# EAGLE design Binary_Sequencer_board1_Arduino (EAGLE 9.1.1)
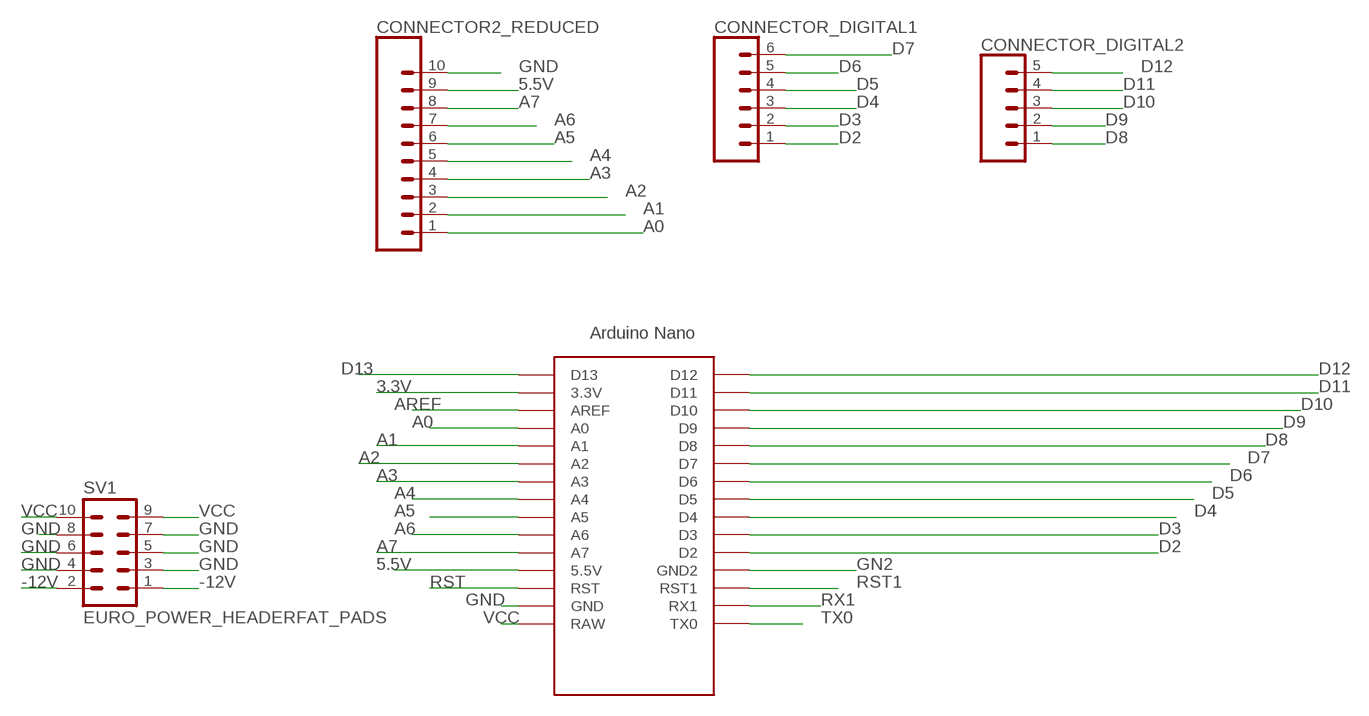
[diagram p0: schematic, sheet 1]

## Parts
CONNECTOR2_REDUCED  CONN_10_LONGPADS10_LONGPADS  [1X10_LONGPADS]
CONNECTOR_DIGITAL1  CONN_06LONGPADS  [1X06_LONGPADS]
CONNECTOR_DIGITAL2  CONN_05PTH_LONGPADS  [1X05_LONGPADS]
SV1  EURO_POWER_HEADERFAT_PADS  [EURO_PWR_HEADER_FAT]
U$1  NANO  [NANO]

## Nets
3.3V: U$1.3.3V
5.5V: CONNECTOR2_REDUCED.9 U$1.5V(5.5V)
-12V: SV1.1 SV1.2
A0: CONNECTOR2_REDUCED.1 U$1.A0
A1: CONNECTOR2_REDUCED.2 U$1.A1
A2: CONNECTOR2_REDUCED.3 U$1.A2
A3: CONNECTOR2_REDUCED.4 U$1.A3
A4: CONNECTOR2_REDUCED.5 U$1.A4
A5: CONNECTOR2_REDUCED.6 U$1.A5
A6: CONNECTOR2_REDUCED.7 U$1.A6
A7: CONNECTOR2_REDUCED.8 U$1.A7
AREF: U$1.AREF
D2: CONNECTOR_DIGITAL1.1 U$1.D2
D3: CONNECTOR_DIGITAL1.2 U$1.D3
D4: CONNECTOR_DIGITAL1.3 U$1.D4
D5: CONNECTOR_DIGITAL1.4 U$1.D5
D6: CONNECTOR_DIGITAL1.5 U$1.D6
D7: CONNECTOR_DIGITAL1.6 U$1.D7
D8: CONNECTOR_DIGITAL2.1 U$1.D8
D9: CONNECTOR_DIGITAL2.2 U$1.D9
D10: CONNECTOR_DIGITAL2.3 U$1.D10
D11: CONNECTOR_DIGITAL2.4 U$1.D11
D12: CONNECTOR_DIGITAL2.5 U$1.D12
D13: U$1.D13
GN2: U$1.GND1(GND2)
GND: CONNECTOR2_REDUCED.10 SV1.3 SV1.4 SV1.5 SV1.6 SV1.7 SV1.8 U$1.GND
RST: U$1.RST
RST1: U$1.RST1
RX1: U$1.RX1
TX0: U$1.TX0
VCC: SV1.9 SV1.10 U$1.RAW

## Library data of the parts
CONNECTOR2_REDUCED = 10_Long_Pads:CONN_10_LONGPADS: Multi connection point. Often used as Generic Header-pin footprint for 0.1 inch spaced/style header connections On any of the 0.1 inch spaced packages, you can populate with these: Break Away Headers - Straight <https://www.sparkfun.com/products/116> (PRT-00116) Break Away Male Headers - Right Angle <https://www.sparkfun.com/products/553> (PRT-00553) Female Headers <https://www.sparkfun.com/products/115> (PRT-00115) Break Away Headers - Machine Pin <https://www.sparkfun.com/products/117> (PRT-00117) Break Away Female Headers - Swiss Machine Pin <https://www.sparkfun.com/products/743> (PRT-00743) For SCREWTERMINALS and SPRING TERMINALS visit here: Screw Terimnals on SparkFun.com <https://www.sparkfun.com/search/results?term=Screw+Terminals> (5mm/3.5mm/2.54mm spacing) This device is also useful as a general connection point to wire up your design to another part of your project. Our various solder wires solder well into these plated through hole pads. Hook-Up Wire - Assortment (Stranded, 22 AWG) <https://www.sparkfun.com/products/11375> (PRT-11375) Hook-Up Wire - Assortment (Solid Core, 22 AWG) <https://www.sparkfun.com/products/11367> (PRT-11367) View the entire wire category on our website here <https://www.sparkfun.com/categories/141>
CONNECTOR_DIGITAL1 = SparkFun-Connectors:CONN_06: Multi connection point. Often used as Generic Header-pin footprint for 0.1 inch spaced/style header connections On any of the 0.1 inch spaced packages, you can populate with these: Break Away Headers - Straight <https://www.sparkfun.com/products/116> (PRT-00116) Break Away Male Headers - Right Angle <https://www.sparkfun.com/products/553> (PRT-00553) Female Headers <https://www.sparkfun.com/products/115> (PRT-00115) Break Away Headers - Machine Pin <https://www.sparkfun.com/products/117> (PRT-00117) Break Away Female Headers - Swiss Machine Pin <https://www.sparkfun.com/products/743> (PRT-00743) Arduino Stackable Header - 6 Pin <https://www.sparkfun.com/products/9280> (PRT-09280) For SCREWTERMINALS and SPRING TERMINALS visit here: Screw Terimnals on SparkFun.com <https://www.sparkfun.com/search/results?term=Screw+Terminals> (5mm/3.5mm/2.54mm spacing) This device is also useful as a general connection point to wire up your design to another part of your project. Our various solder wires solder well into these plated through hole pads. Hook-Up Wire - Assortment (Stranded, 22 AWG) <https://www.sparkfun.com/products/11375> (PRT-11375) Hook-Up Wire - Assortment (Solid Core, 22 AWG) <https://www.sparkfun.com/products/11367> (PRT-11367) View the entire wire category on our website here <https://www.sparkfun.com/categories/141>
CONNECTOR_DIGITAL2 = SparkFun-Connectors:CONN_05: Multi connection point. Often used as Generic Header-pin footprint for 0.1 inch spaced/style header connections On any of the 0.1 inch spaced packages, you can populate with these: Break Away Headers - Straight <https://www.sparkfun.com/products/116> (PRT-00116) Break Away Male Headers - Right Angle <https://www.sparkfun.com/products/553> (PRT-00553) Female Headers <https://www.sparkfun.com/products/115> (PRT-00115) Break Away Headers - Machine Pin <https://www.sparkfun.com/products/117> (PRT-00117) Break Away Female Headers - Swiss Machine Pin <https://www.sparkfun.com/products/743> (PRT-00743) For SCREWTERMINALS and SPRING TERMINALS visit here: Screw Terimnals on SparkFun.com <https://www.sparkfun.com/search/results?term=Screw+Terminals> (5mm/3.5mm/2.54mm spacing) This device is also useful as a general connection point to wire up your design to another part of your project. Our various solder wires solder well into these plated through hole pads. Hook-Up Wire - Assortment (Stranded, 22 AWG) <https://www.sparkfun.com/products/11375> (PRT-11375) Hook-Up Wire - Assortment (Solid Core, 22 AWG) <https://www.sparkfun.com/products/11367> (PRT-11367) View the entire wire category on our website here <https://www.sparkfun.com/categories/141> Special notes: Molex polarized connector foot print use with SKU : PRT-08231 with associated crimp pins and housings. 1MM SMD Version SKU: PRT-10208
SV1 = MusicThingModular:EURO_POWER_HEADER: Power Header 10 pin power header for Eurorack Power Supplies Variants with fatter pads for easier soldering, and the LOCK variant which has 5mil offset pins to hold the component in place before soldering
U$1 = Arduino-clone_EDITED_coordinates:NANO: Arduino Nano

## Board
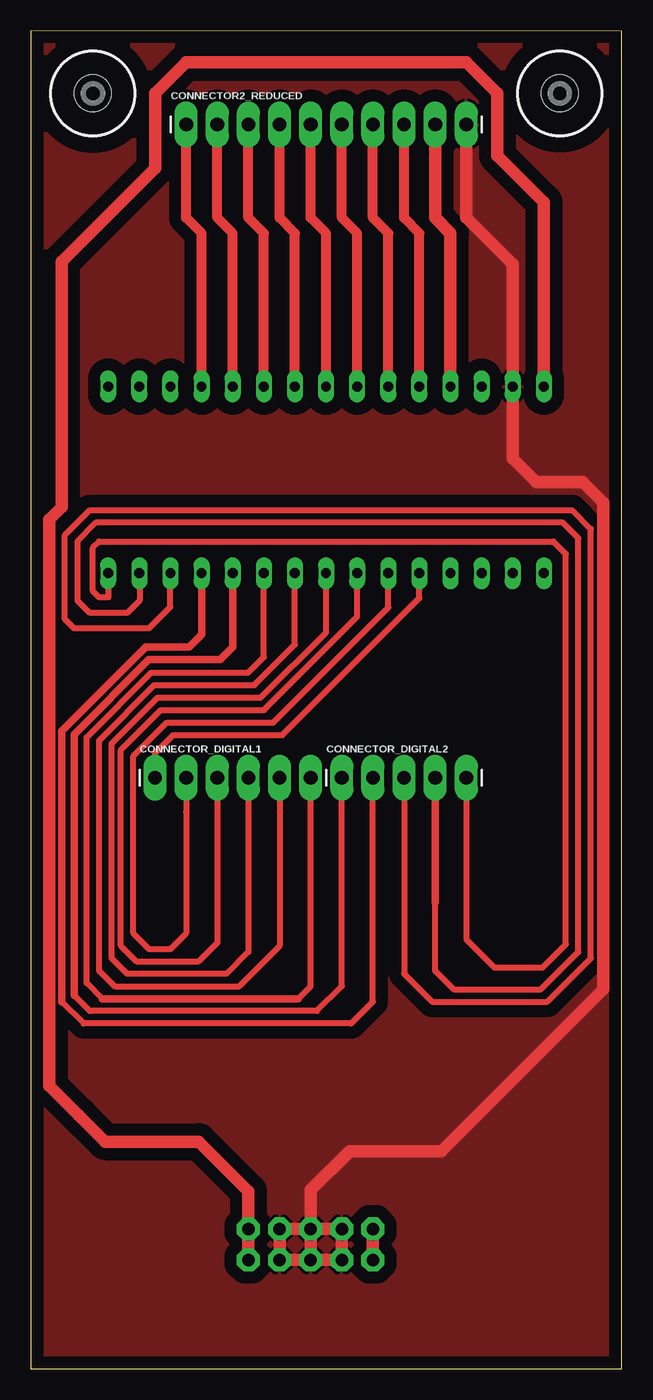
[diagram p1: board, top side]
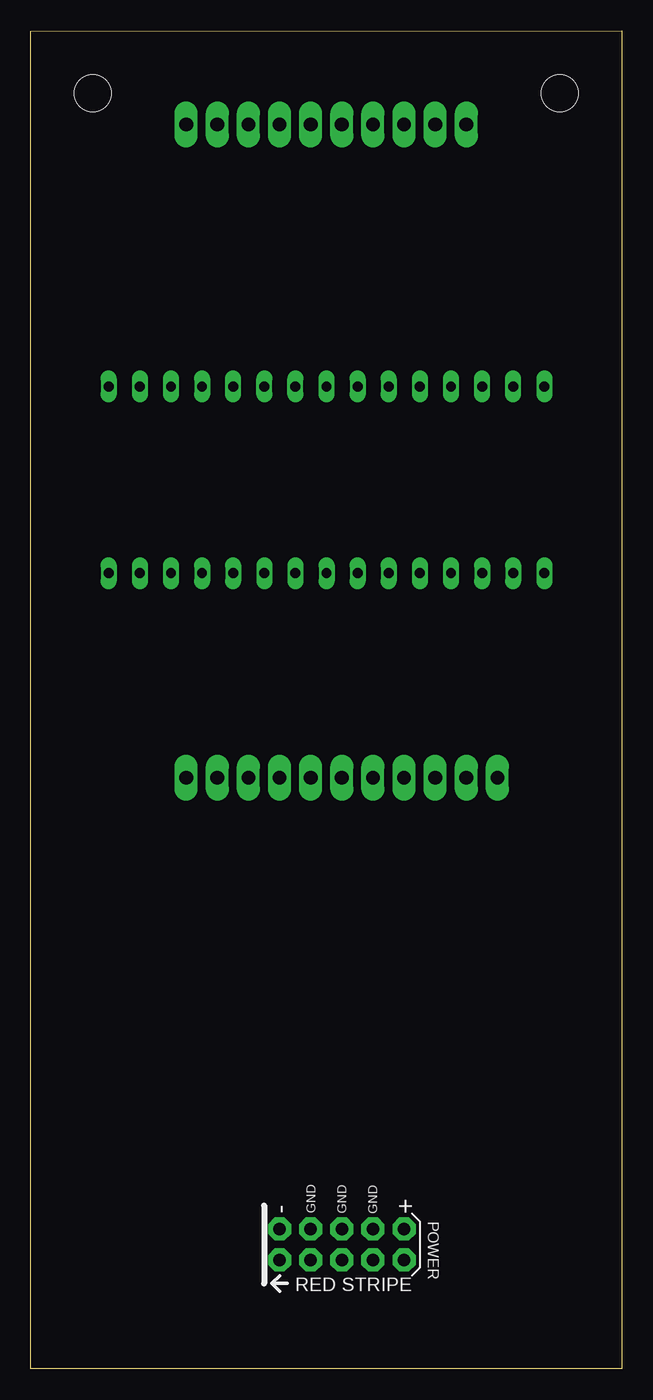
[diagram p2: board, bottom side, seen from below]

Size 48.26 x 109.27 mm. Coordinates in mm from the lower left corner, seen from the top.
Outline: 0,0 48.26,0 48.26,109.22 0,109.27 0,0
Copper layers (1*16): Top 0.035mm / dielectric 1.5mm / Bottom 0.035mm
Design rules "default": minimum track width 6mil, minimum drill 0.35mm, track to track 6mil, track to pad 6mil, pad to pad 6mil, via to via 6mil, smd to smd 6mil, copper to edge 40mil, drill to drill 6mil, minimum pad ring 10mil, minimum via ring 8mil, stop-mask expansion 4mil, vias tented up to drill 0mil, thermal gap 10mil

### Footprints (pad centres in the part's own frame; a part is rotated, then mirrored left to right if it is on the bottom)
1X10_LONGPADS = drill 1.118 pad 1.88 long: 1 0,0; 2 2.54,0; 3 5.08,0; 4 7.62,0; 5 10.16,0; 6 12.7,0; 7 15.24,0; 8 17.78,0; 9 20.32,0; 10 22.86,0
1X06_LONGPADS = drill 1.118 pad 1.88 long: 1 0,0; 2 2.54,0; 3 5.08,0; 4 7.62,0; 5 10.16,0; 6 12.7,0
1X05_LONGPADS = drill 1.118 pad 1.88 long: 1 0,0; 2 2.54,0; 3 5.08,0; 4 7.62,0; 5 10.16,0
DRIL-3 = hole 3: 0,0
EURO_PWR_HEADER_FAT = drill 1.016 pad 1.88 octagon: 1 -5.08,-1.27; 2 -5.08,1.27; 3 -2.54,-1.27; 4 -2.54,1.27; 5 0,-1.27; 6 0,1.27; 7 2.54,-1.27; 8 2.54,1.27; 9 5.08,-1.27; 10 5.08,1.27
NANO = drill 0.8 long: 3.3V 0,33.02; 5V 0,7.62; A0 0,27.94; A1 0,25.4; A2 0,22.86; A3 0,20.32; A4 0,17.78; A5 0,15.24; A6 0,12.7; A7 0,10.16; AREF 0,30.48; D2 15.24,10.16; D3 15.24,12.7; D4 15.24,15.24; D5 15.24,17.78; D6 15.24,20.32; D7 15.24,22.86; D8 15.24,25.4; D9 15.24,27.94; D10 15.24,30.48; D11 15.24,33.02; D12 15.24,35.56; D13 0,35.56; GND 0,2.54; GND1 15.24,7.62; RAW 0,0; RST 0,5.08; RST1 15.24,5.08; RX1 15.24,2.54; TX0 15.24,0

### Placement (x,y rotation side)
CONNECTOR2_REDUCED  12.7,101.6 0 top
CONNECTOR_DIGITAL1  10.16,48.26 0 top
CONNECTOR_DIGITAL2  25.4,48.26 0 top
H1  [DRIL-3]  5.08,104.14 0 top
H2  [DRIL-3]  43.18,104.14 0 top
SV1  22.86,10.16 0 bottom
U$1  41.89,80.21 270 bottom

### Tracks (layer width: path | path; a pad name or v marks a point on that pad's centre or on a via)
5.5V
  Top 1.016: U$1.5V 34.27,92.73 33.02,93.98 CONNECTOR2_REDUCED.9
-12V
  Top 1.016: SV1.1 SV1.2
A0
  Top 0.813: U$1.A0 13.95,92.73 12.7,93.98 CONNECTOR2_REDUCED.1
A1
  Top 0.813: U$1.A1 16.49,92.73 15.24,93.98 CONNECTOR2_REDUCED.2
A2
  Top 0.813: U$1.A2 19.03,92.73 17.78,93.98 CONNECTOR2_REDUCED.3
A3
  Top 0.813: U$1.A3 21.57,92.73 20.32,93.98 CONNECTOR2_REDUCED.4
A4
  Top 0.813: U$1.A4 24.11,92.73 22.86,93.98 CONNECTOR2_REDUCED.5
A5
  Top 0.813: U$1.A5 26.65,92.73 25.4,93.98 CONNECTOR2_REDUCED.6
A6
  Top 0.813: U$1.A6 29.19,92.73 27.94,93.98 CONNECTOR2_REDUCED.7
A7
  Top 0.813: U$1.A7 31.73,92.73 30.48,93.98 CONNECTOR2_REDUCED.8
D2
  Top 0.508: U$1.D2 31.73,62.94 20.55,51.76 11.62,51.76 10.16,50.29 CONNECTOR_DIGITAL1.1
D3
  Top 0.508: U$1.D3 29.19,62.18 19.79,52.78 11.12,52.78 8.38,50.04 8.38,35.56 9.65,34.29 11.43,34.29 12.7,35.56 12.7,45.47 CONNECTOR_DIGITAL1.2
D4
  Top 0.508: U$1.D4 26.65,61.41 19.03,53.79 10.61,53.79 7.37,50.55 7.37,34.54 8.64,33.27 13.72,33.27 15.24,34.8 15.24,43.94 CONNECTOR_DIGITAL1.3
D5
  Top 0.508: CONNECTOR_DIGITAL1.4 17.78,34.04 16,32.26 7.87,32.26 6.6,33.53 6.6,51.05 10.36,54.81 18.78,54.81 24.11,60.14 U$1.D5
D6
  Top 0.508: CONNECTOR_DIGITAL1.5 20.32,34.54 17.02,31.24 6.86,31.24 5.59,32.51 5.59,51.31 10.11,55.83 18.27,55.83 21.57,59.13 U$1.D6
D7
  Top 0.508: 21.84,30.23 22.86,31.24 CONNECTOR_DIGITAL1.6 | 5.84,30.23 4.57,31.5 4.57,51.56 9.85,56.84 17.76,56.84 19.03,58.11 U$1.D7
  Top 0.61: 21.84,30.23 5.84,30.23
D8
  Top 0.508: 3.56,30.48 4.83,29.21 23.37,29.21 25.4,31.24 CONNECTOR_DIGITAL2.1
  Top 0.61: U$1.D8 16.51,64.95 16.51,58.93 15.49,57.91 9.65,57.91 3.56,51.82 3.56,30.48
D9
  Top 0.508: 2.54,29.97 4.32,28.19 26.16,28.19 27.94,29.97 CONNECTOR_DIGITAL2.2
  Top 0.61: 2.54,29.97 2.54,52.07 9.4,58.93 12.95,58.93 13.97,59.94 13.97,64.95 U$1.D9
D10
  Top 0.508: U$1.D10 11.41,62.21 9.65,60.45 3.56,60.45 2.79,61.21 2.79,68.07 4.83,70.1 44.2,70.1 45.72,68.58 45.72,33.53 42.16,29.97 32.77,29.97 30.48,32.26 CONNECTOR_DIGITAL2.3
D11
  Top 0.508: 33.02,38.1 33.02,32.51 34.54,30.99 41.66,30.99 44.7,34.04 44.7,67.82 43.43,69.09 5.33,69.09 3.81,67.56 3.81,62.74 4.83,61.72 7.87,61.72 8.89,62.74 8.89,64.95 U$1.D11
  Top 0.61: 33.02,38.1 CONNECTOR_DIGITAL2.4
D12
  Top 0.508: CONNECTOR_DIGITAL2.5 35.56,35.05 37.85,32.77 41.78,32.77 43.69,34.67 43.69,66.55 42.67,67.56 5.59,67.56 5.08,67.06 5.08,63.5 5.59,62.99 6.35,62.99 6.35,64.95 U$1.D12
GND
  Top 0.813: 24.13,8.89 SV1.5
  Top 1.016: SV1.6 SV1.8 SV1.7 24.13,8.89 SV1.3 SV1.4 SV1.6 | SV1.6 SV1.5 | CONNECTOR2_REDUCED.10 35.56,93.98 39.35,90.19 U$1.GND 39.35,74.95 39.35,74.31 41.27,72.39 45.09,72.39 46.74,70.74 46.74,30.99 33.53,17.78 26.04,17.78 22.86,14.61 SV1.6
  pour Top (isolate 1): 0,109.22 48.26,109.22 48.26,0 0,0
N$1
  pour Top (isolate 1.016): 0,90.17 0.51,89.66 48.51,89.66 48.51,109.22 0,109.22
VCC
  Top 1.016: U$1.RAW 41.89,95.27 38.1,99.06 38.1,104.14 35.56,106.68 12.7,106.68 10.16,104.14 10.16,98.04 2.54,90.42 2.54,70.36 1.52,69.34 1.52,23.11 3.94,20.7 6.1,18.54 13.72,18.54 17.78,14.48 17.78,10.92 | SV1.9 17.78,10.92 | 17.78,10.92 SV1.10

### Text on the board
tDocu: A0 | A7 | 5.5V | GND | D2 | D4 | D7
bDocu: A4 | D13 | 3.3V | AREF | A0 | A1 | A2 | A3 | A4 | A5 | A6 | A7 | 5.5V | RST | GND | RAW | D12 | D11 | D10 | D9 | D8 | D7 | D6 | D5 | D4 | D3 | D2 | GND | RST1 | RX1 | TX0